# Altium schematic sheet N-CW7_UserInterface.SchDoc
size A3; SheetNumber: 2; SheetTotal: 3
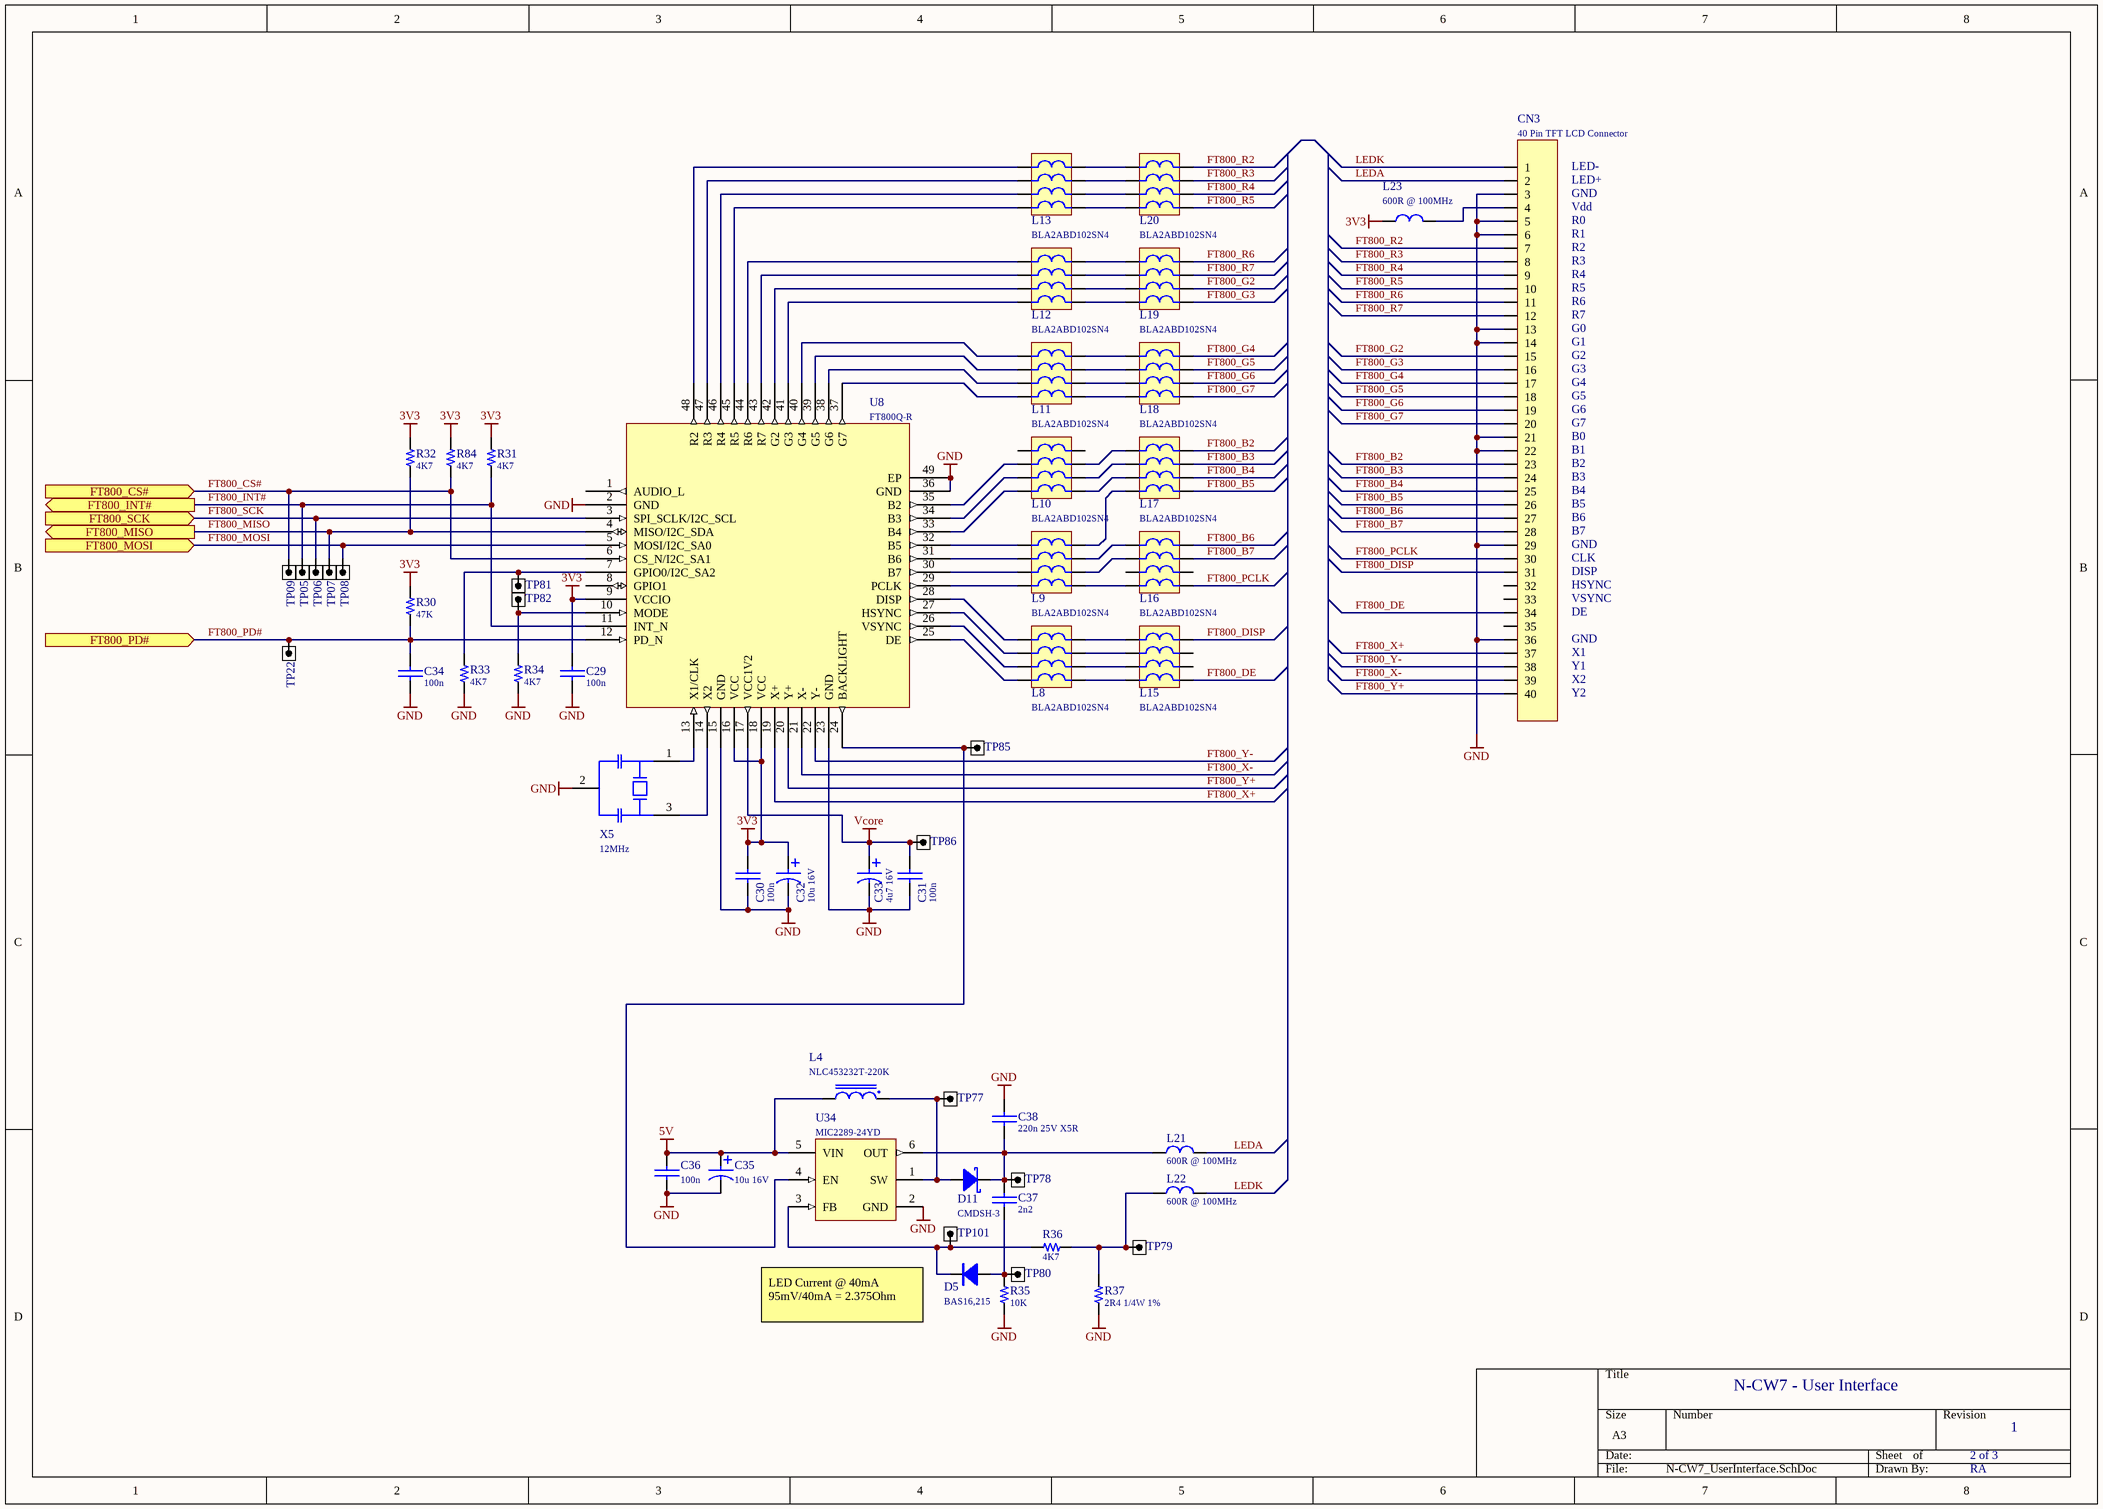
[diagram p0: N-CW7_UserInterface.SchDoc]

## Parts
C29  100n  [TDK_0603_T0.80:CAPC1608X08N]
C30  100n  [TDK_0603_T0.80:CAPC1608X08N]
C31  100n  [TDK_0603_T0.80:CAPC1608X08N]
C32  10u 16V  [KEMET_T494B/3528-21:CAPMP3528X19N]
C33  4u7 16V  [KEMET_T494A/3216-18:CAPCP3216X16N]
C34  100n  [TDK_0603_T0.80:CAPC1608X08N]
C35  10u 16V  [KEMET_T494B/3528-21:CAPMP3528X19N]
C36  100n  [TDK_0603_T0.80:CAPC1608X08N]
C37  2n2  [TDK_0603_T0.80:CAPC1608X08N]
C38  220n 25V X5R  [AVX_0805_T1.40:CAPC2012X14N]
CN3  40 Pin TFT LCD Connector  [FCI_62684-402100ALF]
D5  BAS16,215  [NEXPERIA_BAS16,215_SOT_23:SOT95P230X110-3N]
D11  CMDSH-3  [CSEMI_CMDSH-3_SOD323]
L4  NLC453232T-220K  [TDK_NLC453232T-220K]
L8  BLA2ABD102SN4  [MURATA_BLA2ABD102SN4_0804:CAF-50P200X100-8N]
L9  BLA2ABD102SN4  [MURATA_BLA2ABD102SN4_0804:CAF-50P200X100-8N]
L10  BLA2ABD102SN4  [MURATA_BLA2ABD102SN4_0804:CAF-50P200X100-8N]
L11  BLA2ABD102SN4  [MURATA_BLA2ABD102SN4_0804:CAF-50P200X100-8N]
L12  BLA2ABD102SN4  [MURATA_BLA2ABD102SN4_0804:CAF-50P200X100-8N]
L13  BLA2ABD102SN4  [MURATA_BLA2ABD102SN4_0804:CAF-50P200X100-8N]
L15  BLA2ABD102SN4  [MURATA_BLA2ABD102SN4_0804:CAF-50P200X100-8N]
L16  BLA2ABD102SN4  [MURATA_BLA2ABD102SN4_0804:CAF-50P200X100-8N]
L17  BLA2ABD102SN4  [MURATA_BLA2ABD102SN4_0804:CAF-50P200X100-8N]
L18  BLA2ABD102SN4  [MURATA_BLA2ABD102SN4_0804:CAF-50P200X100-8N]
L19  BLA2ABD102SN4  [MURATA_BLA2ABD102SN4_0804:CAF-50P200X100-8N]
L20  BLA2ABD102SN4  [MURATA_BLA2ABD102SN4_0804:CAF-50P200X100-8N]
L21  600R @ 100MHz  [LAIRD_MI0805K601R-10:INDC2012X09N]
L22  600R @ 100MHz  [LAIRD_MI0805K601R-10:INDC2012X09N]
L23  600R @ 100MHz  [LAIRD_MI0805K601R-10:INDC2012X09N]
R30  47K  [YAGEO_0603_T0.55:RESC1608X06N]
R31  4K7  [YAGEO_0603_T0.55:RESC1608X06N]
R32  4K7  [YAGEO_0603_T0.55:RESC1608X06N]
R33  4K7  [YAGEO_0603_T0.55:RESC1608X06N]
R34  4K7  [YAGEO_0603_T0.55:RESC1608X06N]
R35  10K  [YAGEO_0603_T0.55:RESC1608X06N]
R36  4K7  [YAGEO_0603_T0.55:RESC1608X06N]
R37  2R4 1/4W 1%  [PANASONIC_ERJ-3B:RESC1608X04N]
R84  4K7  [YAGEO_0603_T0.55:RESC1608X06N]
TP05  TESTPOINT_OCTAGONAL  [TESTPOINT_OCTAGONAL]  (value not drawn)
TP06  TESTPOINT_OCTAGONAL  [TESTPOINT_OCTAGONAL]  (value not drawn)
TP07  TESTPOINT_OCTAGONAL  [TESTPOINT_OCTAGONAL]  (value not drawn)
TP08  TESTPOINT_OCTAGONAL  [TESTPOINT_OCTAGONAL]  (value not drawn)
TP09  TESTPOINT_OCTAGONAL  [TESTPOINT_OCTAGONAL]  (value not drawn)
TP22  TESTPOINT_OCTAGONAL  [TESTPOINT_OCTAGONAL]  (value not drawn)
TP77  TESTPOINT_OCTAGONAL  [TESTPOINT_OCTAGONAL]  (value not drawn)
TP78  TESTPOINT_OCTAGONAL  [TESTPOINT_OCTAGONAL]  (value not drawn)
TP79  TESTPOINT_OCTAGONAL  [TESTPOINT_OCTAGONAL]  (value not drawn)
TP80  TESTPOINT_OCTAGONAL  [TESTPOINT_OCTAGONAL]  (value not drawn)
TP81  TESTPOINT_OCTAGONAL  [TESTPOINT_OCTAGONAL]  (value not drawn)
TP82  TESTPOINT_OCTAGONAL  [TESTPOINT_OCTAGONAL]  (value not drawn)
TP85  TESTPOINT_OCTAGONAL  [TESTPOINT_OCTAGONAL]  (value not drawn)
TP86  TESTPOINT_OCTAGONAL  [TESTPOINT_OCTAGONAL]  (value not drawn)
TP101  TESTPOINT_OCTAGONAL  [TESTPOINT_OCTAGONAL]  (value not drawn)
U8  FT800Q-R  [BRIDGETEK_FT800Q-R_VQFN48:QFN50P700X700X90_HS-49N]
U34  MIC2289-24YD  [MICREL_MIC2289-24YD_SOT236:SOT95P280X100-6N]
X5  12MHz  [MURATA_CSTNE12M0G520000R0]

## Ports
FT800_CS# (in), FT800_INT# (out), FT800_MISO (out), FT800_MOSI (in), FT800_PD# (in), FT800_SCK (in)

## Nets
3V3: C29.2 C30.2 C32.1 L23.1 R30.2 R31.1 R32.1 R84.1 U8.9(VCCIO) U8.16(VCC) U8.18(VCC)
5V: C35.1 C36.1 L4.2 U34.5(VIN)
GND: C29.1 C30.1 C31.1 C32.2 C33.2 C34.1 C35.2 C36.2 C38.2 CN3.3 CN3.5 CN3.6 CN3.13 CN3.14 CN3.21 CN3.22 CN3.29 CN3.36 R33.2 R34.2 R35.1 R37.1 U8.2(GND) U8.15(GND) U8.23(GND) U8.36(GND) U8.49(EP) U34.2(GND) X5.2
Vcore: C31.2 C33.1 TP86.1 U8.17(VCC1V2)
FT800_B2: CN3.23 L17.8
FT800_B3: CN3.24 L17.7
FT800_B4: CN3.25 L17.6
FT800_B5: CN3.26 L17.5
FT800_B6: CN3.27 L16.8
FT800_B7: CN3.28 L16.7
FT800_CS#: R84.2 TP09.1 U8.6(CS_N/I2C_SA1) ; port FT800_CS#
FT800_DE: CN3.34 L15.5
FT800_DISP: CN3.31 L15.8
FT800_G2: CN3.15 L19.6
FT800_G3: CN3.16 L19.5
FT800_G4: CN3.17 L18.8
FT800_G5: CN3.18 L18.7
FT800_G6: CN3.19 L18.6
FT800_G7: CN3.20 L18.5
FT800_INT#: R31.2 TP05.1 U8.11(INT_N) ; port FT800_INT#
FT800_MISO: R32.2 TP07.1 U8.4(MISO/I2C_SDA) ; port FT800_MISO
FT800_MOSI: TP08.1 U8.5(MOSI/I2C_SA0) ; port FT800_MOSI
FT800_PCLK: CN3.30 L16.5
FT800_PD#: C34.2 R30.1 TP22.1 U8.12(PD_N) ; port FT800_PD#
FT800_R2: CN3.7 L20.8
FT800_R3: CN3.8 L20.7
FT800_R4: CN3.9 L20.6
FT800_R5: CN3.10 L20.5
FT800_R6: CN3.11 L19.8
FT800_R7: CN3.12 L19.7
FT800_SCK: TP06.1 U8.3(SPI_SCLK/I2C_SCL) ; port FT800_SCK
FT800_X+: CN3.37 U8.19(X+)
FT800_X-: CN3.39 U8.21(X-)
FT800_Y+: CN3.40 U8.20(Y+)
FT800_Y-: CN3.38 U8.22(Y-)
LEDA: CN3.2 L21.2
LEDK: CN3.1 L22.2
NetC37_1: C37.1 D5.1(A) R35.2 TP80.1
NetC37_2: C37.2 C38.1 D11.1(K) L21.1 TP78.1 U34.6(OUT)
NetCN3_4: CN3.4 L23.2
NetD5_3: D5.3(K) R36.2 TP101.1 U34.3(FB)
NetD11_2: D11.2(A) L4.1 TP77.1 U34.1(SW)
NetL8_1: L8.1 U8.28(DISP)
NetL8_2: L8.2 U8.27(HSYNC)
NetL8_3: L8.3 U8.26(VSYNC)
NetL8_4: L8.4 U8.25(DE)
NetL8_5: L8.5 L15.4
NetL8_6: L8.6 L15.3
NetL8_7: L8.7 L15.2
NetL8_8: L8.8 L15.1
NetL9_1: L9.1 U8.32(B5)
NetL9_2: L9.2 U8.31(B6)
NetL9_3: L9.3 U8.30(B7)
NetL9_4: L9.4 U8.29(PCLK)
NetL9_5: L9.5 L16.4
NetL9_6: L9.6 L16.2
NetL9_7: L9.7 L16.1
NetL9_8: L9.8 L17.4
NetL10_2: L10.2 U8.35(B2)
NetL10_3: L10.3 U8.34(B3)
NetL10_4: L10.4 U8.33(B4)
NetL10_5: L10.5 L17.3
NetL10_6: L10.6 L17.2
NetL10_7: L10.7 L17.1
NetL11_1: L11.1 U8.40(G4)
NetL11_2: L11.2 U8.39(G5)
NetL11_3: L11.3 U8.38(G6)
NetL11_4: L11.4 U8.37(G7)
NetL11_5: L11.5 L18.4
NetL11_6: L11.6 L18.3
NetL11_7: L11.7 L18.2
NetL11_8: L11.8 L18.1
NetL12_1: L12.1 U8.44(R6)
NetL12_2: L12.2 U8.43(R7)
NetL12_3: L12.3 U8.42(G2)
NetL12_4: L12.4 U8.41(G3)
NetL12_5: L12.5 L19.4
NetL12_6: L12.6 L19.3
NetL12_7: L12.7 L19.2
NetL12_8: L12.8 L19.1
NetL13_1: L13.1 U8.48(R2)
NetL13_2: L13.2 U8.47(R3)
NetL13_3: L13.3 U8.46(R4)
NetL13_4: L13.4 U8.45(R5)
NetL13_5: L13.5 L20.4
NetL13_6: L13.6 L20.3
NetL13_7: L13.7 L20.2
NetL13_8: L13.8 L20.1
NetL22_1: L22.1 R36.1 R37.2 TP79.1
NetR33_1: R33.1 TP81.1 U8.7(GPIO0/I2C_SA2)
NetR34_1: R34.1 TP82.1 U8.10(MODE)
NetTP85_1: TP85.1 U8.24(BACKLIGHT) U34.4(EN)
NetU8_13: U8.13(X1/CLK) X5.1
NetU8_14: U8.14(X2) X5.3

Not connected (* = marked no-connect by the designer): CN3 32 33 35; L10 1 8; L15 6 7; L16 3 6; U8 1(AUDIO_L) 8(GPIO1)

## Notes on the sheet
- LED-
- LED+
- GND
- Vdd
- R0
- R1
- R2
- R3
- R4
- R5
- R6
- R7
- G0
- G1
- G2
- G3
- G4
- G5
- G6
- G7
- B0
- B1
- B2
- B3
- B4
- B5
- B6
- B7
- CLK
- DISP
- HSYNC
- VSYNC
- DE
- X1
- Y1
- X2
- Y2
- LED Current @ 40mA
  95mV/40mA = 2.375Ohm
- N-CW7 - User Interface
- 2 of 3
- 1
- RA

## Library data of the parts
C29-C31 C34 C36 = TDK_0603_T0.80: CAP CER 0.1UF 50V X7R 0603; Manufacturer: TDK; Manufacturer Part Number: C1608X7R1H104K080AA; ComponentLink1Description: Datasheet - TDK; ComponentLink1URL: https://product.tdk.com/system/files/dam/doc/product/capacitor/ceramic/mlcc/catalog/mlcc_commercial_general_en.pdf; Supplier 1: Digi-Key; Supplier Part Number 1: 445-1314-1-ND; Supplier 2: Mouser; Supplier Part Number 2: 810-C1608X7R1H104K
C32 C35 = KEMET_T494B/EIA3528-21: CAP TANT 10UF 10% 16V 1411; Manufacturer: KEMET; Manufacturer Part Number: T494B106K016AT; ComponentLink1Description: Datasheet - KEMET; ComponentLink1URL: https://datasheet.ciiva.com/6229/kem-t2008-t494-6229597.pdf?src-supplier=Digi-Key; Supplier 1: Mouser; Supplier Part Number 1: 80-T494B106K016; Supplier 2: Digikey; Supplier Part Number 2: 399-3830-1-ND
C33 = KEMET_T494A/EIA3216-18: CAP TANT 4.7UF 10% 16V 1206; Manufacturer: KEMET; Manufacturer Part Number: T494A475K016AT; ComponentLink1Description: Datasheet - KEMET; ComponentLink1URL: https://datasheet.ciiva.com/6229/kem-t2008-t494-6229597.pdf?src-supplier=Digi-Key; Supplier 1: Mouser; Supplier Part Number 1: 80-T494A475K016; Supplier 2: Digikey; Supplier Part Number 2: 399-8439-1-ND
C37 = TDK_0603_T0.80: CAP CER 2200PF 50V X7R 0603; Manufacturer: TDK; Manufacturer Part Number: C1608X7R1H222K080AE; ComponentLink1Description: Datasheet - TDK; ComponentLink1URL: https://product.tdk.com/system/files/dam/doc/product/capacitor/ceramic/mlcc/catalog/mlcc_commercial_general_en.pdf; Supplier 1: Digikey; Supplier Part Number 1: 445-173664-1-ND; Supplier 2: Mouser; Supplier Part Number 2: 810-C1608X7R1H222KAE
C38 = AVX_0805_T1.40: CAP CER 220n 25V X5R 0805; Supplier 1: Mouser; Supplier Part Number 1: 581-08053D224MAT2A; ComponentLink1Description: Datasheet - AVX; ComponentLink1URL: https://au.mouser.com/datasheet/2/40/cx5r_KGM-3223198.pdf
CN3 = FCI_62684-402100ALF: CONN FPC TOP 40POS 0.5MM R/A; Manufacturer: Amphenol ICC / FCI; Manufacturer Part Number: 62684-402100ALF; Supplier 1: Digikey; Supplier Part Number 1: 609-1200-1-ND; Supplier 2: Mouser; Supplier Part Number 2: 649-62684-402100ALF; ComponentLink1Description: Datasheet - FCI; ComponentLink1URL: https://datasheet.octopart.com/62684-402100ALF-Areva-datasheet-122521.pdf?src-supplier=Digikey
D5 = NEXPERIA_BAS16,215_SOT23: DIODE GP 100V 215MA SOT23; Manufacturer: Nexperia; Manufacturer Part Number: BAS16,215; Supplier 1: Digi-Key; Supplier Part Number 1: 1727-2887-6-ND; Supplier 2: Mouser; Supplier Part Number 2: 771-BAS16-T/R; ComponentLink1Description: Datasheet - NEXPERIA; ComponentLink1URL: https://assets.nexperia.com/documents/data-sheet/BAS16_SER.pdf?src-supplier=Digi-Key
D11 = CSEMI_CMDSH-3_SOD323: DIODE SCHOTTKY 30V 100MA SOD323; Manufacturer: Central Semiconductor; Manufacturer Part Number: CMDSH-3 TR PBFREE; Supplier 1: Digikey; Supplier Part Number 1: 1514-CMDSH-3TRPBFREECT-ND; Supplier 2: Mouser; Supplier Part Number 2: 610-CMDSH-3; ComponentLink1Description: Datasheet - CENTRAL SEMI; ComponentLink1URL: https://datasheet.octopart.com/CMDSH-3-TR-PBFREE-Central-Semiconductor-datasheet-103422393.pdf?src-supplier=Future+Electronics
L4 = TDK_NLC453232T-220K: 22uH 10%; Manufacturer: TDK; Manufacturer Part Number: NLC453232T-220K-PF; Supplier 1: Newark; Supplier Part Number 1: 33P7817; ComponentLink1Description: Datasheet - TDK; ComponentLink1URL: https://datasheet.ciiva.com/15160/getdatasheetpartid-50514-15160162.pdf?src-supplier=Verical
L8-L13 L15-L20 = MURATA_BLA2ABD102SN4_0804: Ferrite Beads 1000 OHM 25%; Manufacturer: Murata; Manufacturer Part Number: BLA2ABD102SN4B; ComponentLink1Description: Datasheet - MURATA; ComponentLink1URL: https://au.mouser.com/datasheet/2/281/murata_mure-s-a0008870653-1-1740392.pdf
L21-L23 = LAIRD_MI0805K601R-10: FERRITE BEAD 600 OHM 0805 1LN; Manufacturer: Laird; Manufacturer Part Number: MI0805K601R-10; Supplier 1: Digi-Key; Supplier Part Number 1: 240-2390-1-ND; Supplier 2: Mouser; Supplier Part Number 2: 875-MI0805K601R-10; ComponentLink1Description: Datasheet - LAIRD; ComponentLink1URL: https://datasheet.ciiva.com/1013/mi0805k601r-10-b-1013299.pdf?src-supplier=Digi-Key
R30 = YAGEO_0603_T0.55: RES 47K OHM 1% 1/10W 0603; Manufacturer: Yageo; Manufacturer Part Number: RC0603FR-0747KL; ComponentLink1Description: Datasheet - YAGEO; ComponentLink1URL: https://www.yageo.com/upload/media/product/productsearch/datasheet/rchip/PYu-RC_Group_51_RoHS_L_11.pdf; Supplier 1: Digi-Key; Supplier Part Number 1: 311-47.0KHRCT-ND; Supplier 2: Mouser; Supplier Part Number 2: 603-RC0603FR-0747KL
R31-R34 R36 R84 = YAGEO_0603_T0.55: RES 4.7K OHM 1% 1/10W 0603; Manufacturer: Yageo; Manufacturer Part Number: RC0603FR-074K7L; ComponentLink1Description: Datasheet - YAGEO; ComponentLink1URL: https://www.yageo.com/upload/media/product/productsearch/datasheet/rchip/PYu-RC_Group_51_RoHS_L_11.pdf; Supplier 1: Digikey; Supplier Part Number 1: 311-4.70KHRCT-ND; Supplier 2: Mouser; Supplier Part Number 2: 603-RC0603FR-074K7L
R35 = YAGEO_0603_T0.55: RES 10K OHM 1% 1/10W 0603; Manufacturer: Yageo; Manufacturer Part Number: RC0603FR-0710KL; ComponentLink1Description: Datasheet - YAGEO; ComponentLink1URL: https://www.yageo.com/upload/media/product/productsearch/datasheet/rchip/PYu-RC_Group_51_RoHS_L_11.pdf; Supplier 1: Digi-Key; Supplier Part Number 1: 311-10.0KHRCT-ND; Supplier 2: Mouser; Supplier Part Number 2: 603-RC0603FR-0710KL
R37 = PANASONIC_ERJ-3B: RES SMD 2.4 OHM 1% 1/4W 0603; Manufacturer Part Number: ERJ-3BQF2R4V; ComponentLink1Description: Datasheet - PANASONIC; ComponentLink1URL: https://industrial.panasonic.com/cdbs/www-data/pdf/RDN0000/AOA0000C313.pdf; Manufacturer: Panasonic; Supplier 1: Mouser; Supplier Part Number 1: 667-ERJ-3BQF2R4V; Supplier 2: Digikey; Supplier Part Number 2: P17379CT-ND
U8 = BRIDGETEK_FT800Q-R_VQFN48: IC VIDEO CONTROLLER 48VQFN; Manufacturer: Bridgetek; Manufacturer Part Number: FT800Q-R; Supplier 1: Digikey; Supplier Part Number 1: 768-1185-1-ND; Supplier 2: Mouser; Supplier Part Number 2: 895-FT800Q-R; ComponentLink1Description: Datasheet - BRIDGETEK; ComponentLink1URL: https://brtchip.com/wp-content/uploads/Support/Documentation/Datasheets/ICs/EVE/DS_FT800_Embedded_Video_Engine.pdf?src-supplier=Digikey
U34 = MICREL_MIC2289-24YD_SOT236: IC LED DRVR RGLTR PWM TSOT23-6; Manufacturer: Microchip; Manufacturer Part Number: MIC2289-24YD6-TR; Supplier 1: Mouser; Supplier Part Number 1: 998-MIC2289-24YD6TR; Supplier 2: Digikey; Supplier Part Number 2: MIC2289-24YD6-DKR-ND; ComponentLink1Description: Datasheet - MICREL; ComponentLink1URL: https://datasheet.ciiva.com/1947/mic2289-1947700.pdf?src-supplier=Digikey
X5 = MURATA_CSTNE12M0G520000R0: CERAMIC RES 12.0000MHZ 10PF SMD; Manufacturer: Murata; Manufacturer Part Number: CSTNE12M0G520000R0; Supplier 1: Digikey; Supplier Part Number 1: CSTNE12M0G520000R0-ND; ComponentLink1Description: Datasheet - MURATA; ComponentLink1URL: *